# EAGLE design M8-GPIO (EAGLE 9.5.2)
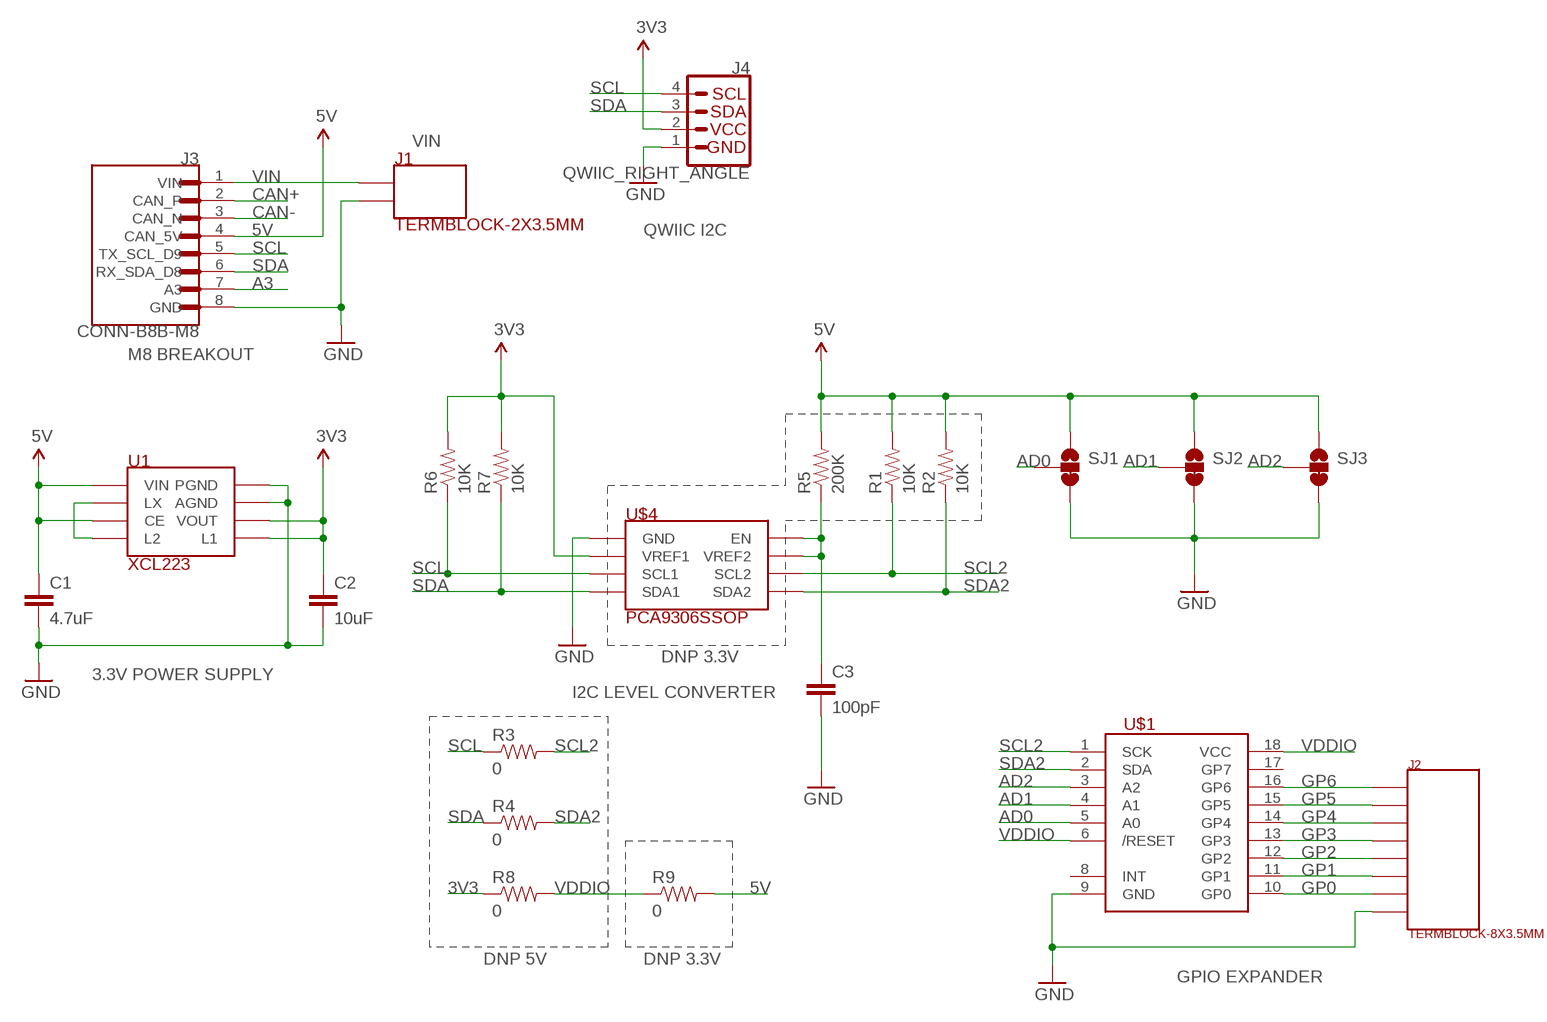
[diagram p0: schematic, sheet 1]

## Parts
C1  4.7uF  CAP-4.7UF-0603  [0603-CAP]
C2  10uF  CAP-10UF-0603  [0603-CAP]
C3  100pF  CAP-100PF-0603  [0603-CAP]
J1  TERMBLOCK-2X3.5MM  [TERMBLOCK-2X3.5MM]
J2  TERMBLOCK-8X3.5MM  [TERMBLOCK-8X3.5MM]
J3  CONN-B8B-M8  [JST_B8B-PH-SM4-TB(LF)(SN)]
J4  QWIIC_RIGHT_ANGLE  QWIIC_CONNECTORJS-1MM  [JST04_1MM_RA]
R1  10K  RES-10K-06030603  [0603-RES]
R2  10K  RES-10K-06030603  [0603-RES]
R3  0  RES-0-0603  [0603-RES]
R4  0  RES-0-0603  [0603-RES]
R5  200K  RES-200K-0603  [0603-RES]
R6  10K  RES-10K-06030603  [0603-RES]
R7  10K  RES-10K-06030603  [0603-RES]
R8  0  RES-0-0603  [0603-RES]
R9  0  RES-0-0603  [0603-RES]
SJ1  JUMPER-PAD-3-2OF3_NC_BY_TRACE_SMALL  [PAD-JUMPER-3-2OF3_NC_BY_TRACE_NO_SILK]
SJ2  JUMPER-PAD-3-2OF3_NC_BY_TRACE_SMALL  [PAD-JUMPER-3-2OF3_NC_BY_TRACE_NO_SILK]
SJ3  JUMPER-PAD-3-2OF3_NC_BY_TRACE_SMALL  [PAD-JUMPER-3-2OF3_NC_BY_TRACE_NO_SILK]
U1  XCL223  REG-XCL223  [REG-XCL223-LESS-CREAM]
U$1  MCP23008  [SOIC-18-W-MAXIM]
U$4  PCA9306SSOP  [8-SSOP-TI]

## Nets
3V3: C2.1 J4.2 R6.2 R7.2 R8.1 U1.3(VOUT) U1.7(L1) U$4.2(VREF1)
5V: C1.1 J3.4(CAN_5V) R1.2 R2.2 R5.2 R9.2 SJ1.1 SJ2.1 SJ3.1 U1.4(CE) U1.6(VIN)
A3: J3.7(A3)
AD0: SJ1.2 U$1.5(A0)
AD1: SJ2.2 U$1.4(A1)
AD2: SJ3.2 U$1.3(A2)
CAN+: J3.2(CAN_P)
CAN-: J3.3(CAN_N)
GND: C1.2 C2.2 C3.2 J1.2 J2.8 J3.8(GND) J4.1 SJ1.3 SJ2.3 SJ3.3 U1.1(PGND) U1.2(AGND) U$1.9(GND) U$4.1(GND)
GP0: J2.7 U$1.10(GP0)
GP1: J2.6 U$1.11(GP1)
GP2: J2.5 U$1.12(GP2)
GP3: J2.4 U$1.13(GP3)
GP4: J2.3 U$1.14(GP4)
GP5: J2.2 U$1.15(GP5)
GP6: J2.1 U$1.16(GP6)
LX: U1.5(LX) U1.8(L2)
SCL: J3.5(TX_SCL_D9) J4.4 R3.1 R6.1 U$4.3(SCL1)
SCL2: R1.1 R3.2 U$1.1(SCK) U$4.6(SCL2)
SDA: J3.6(RX_SDA_D8) J4.3 R4.1 R7.1 U$4.4(SDA1)
SDA2: R2.1 R4.2 U$1.2(SDA) U$4.5(SDA2)
VDDIO: R8.2 R9.1 U$1.6(/RESET) U$1.18(VCC)
VIN: J1.1 J3.1(VIN)
VREF2_EN: C3.1 R5.1 U$4.7(VREF2) U$4.8(EN)
Unconnected: U$1.8(INT) U$1.17(GP7)

## Notes on the sheet
- VIN
- QWIIC I2C
- M8 BREAKOUT
- DNP 3.3V
- 3.3V POWER SUPPLY
- I2C LEVEL CONVERTER
- DNP 5V | DNP 3.3V
- GPIO EXPANDER

## Library data of the parts
C1 = rickk2:CAP-4.7UF-0603: Murata X5R series CAP CER 4.7UF 6.3V X5R 0603 $0.12 https://www.digikey.com/product-detail/en/murata-electronics-north-america/GRM188R60J475KE19J/490-6407-1-ND/3845604
C2 = rickk2:CAP-10UF-0603: CAP CER 10UF 16V X5R 0805 $ 0.21 https://www.digikey.com/product-detail/en/murata-electronics-north-america/GRM21BR61C106KE15L/490-3886-1-ND/965928
C3 = rickk2:CAP-100PF-0603: CAP 100PF 0603
J1 = rickk2:TERMBLOCK-2X3.5MM: TERM BLK 2POS SIDE ENT 3.5MM PCB $0.67 On Shore Technology Inc. OSTTE020161M https://www.digikey.com/products/en?keywords=ED2635-ND
J2 = rickk2:TERMBLOCK-8X3.5MM: TERM BLK 8POS SIDE ENT 3.5MM PCB On Shore Technology Inc. OSTTE080161 $1.73 8 Position Wire to Board Terminal Block Horizontal with Board 0.138" (3.50mm) Through Hole https://www.digikey.com/product-detail/en/on-shore-technology-inc/OSTTE080161/ED2641-ND/614590
J3 = rickk2:CONN-B8B-M8: PH Series 2 mm Pitch 12 Position SMT Single Row Top Entry Shrouded Header
J4 = rickk2:QWIIC_CONNECTOR: SparkFun I2C Standard Qwiic Connector An SMD 1mm pitch JST connector makes it easy and quick (get it? Qwiic?) to connect I2C devices to each other. The Qwiic system <http://www.sparkfun.com/qwiic> enables fast and solderless connection between popular platforms and various sensors and actuators. We carry 200mm <https://www.sparkfun.com/products/14204>, 100mm <https://www.sparkfun.com/products/14205>, 50mm <https://www.sparkfun.com/products/14206>, and breadboard friendly <https://www.sparkfun.com/products/14207> Qwiic cables. We also offer 10 pcs strips <https://www.sparkfun.com/products/14323> the SMD connectors.; PROD_ID: CONN-13694
R1 R2 R6 R7 = rickk2:RES-10K-0603: RES SMD 10K OHM 5% 1/4W 0603 $ 0.10 https://www.digikey.com/product-detail/en/panasonic-electronic-components/ERJ-PA3J103V/P10KBZCT-ND/5036237
R3 R4 R8 R9 = rickk2:RES-0-0603: Not ordered yet RES SMD 0 OHM JUMPER 1/10W 0603 Panasonic Electronic Components ERJ-3GEY0R00V 0 Ohms Jumper 0.1W, 1/10W Chip Resistor 0603 (1608 Metric) Automotive AEC-Q200 Thick Film https://www.digikey.com/product-detail/en/panasonic-electronic-components/ERJ-3GEY0R00V/P0-0GCT-ND/134711
R5 = rickk2:RES-200K-0603: RES SMD 200K https://www.digikey.com/product-detail/en/panasonic-electronic-components/ERJ-3EKF2003V/P200KHCT-ND/198241
SJ1-SJ3 = rickk2:JUMPER-PAD-3-2OF3_NC_BY_TRACE
U1 = rickk2:REG-XCL223: Manufacturer: Torex Semiconductor Ltd Manufacturer Part Number: XCL223A333D2-G DC DC CONVERTER 3.3V Detailed Description: Non-Isolated PoL Modul $2.63 https://www.digikey.com/product-detail/en/torex-semiconductor-ltd/XCL223A333D2-G/893-1416-1-ND/8256118 CIN=4.7uF 10V CL = 10uF 10V VIN MAX=5.5V VOUT=3.3V
U$1 = rickk2:MCP23008: IC I/O EXPANDER I2C 8B 18SOIC $1.08 https://www.digikey.com/product-detail/en/microchip-technology/MCP23008T-E-SO/MCP23008T-E-SOCT-ND/5358243
U$4 = rickk2:PCA9306: IC TRNSLTR BIDIRECTIONAL SM8 PCA9306DCTR $0.67 https://www.digikey.com/product-detail/en/texas-instruments/PCA9306DCTR/296-18509-1-ND/809938 VREF1=3.3V VREF2=5V connect w/200K res and 100 pF cap to GND Use 8-SSOP version!

## Board
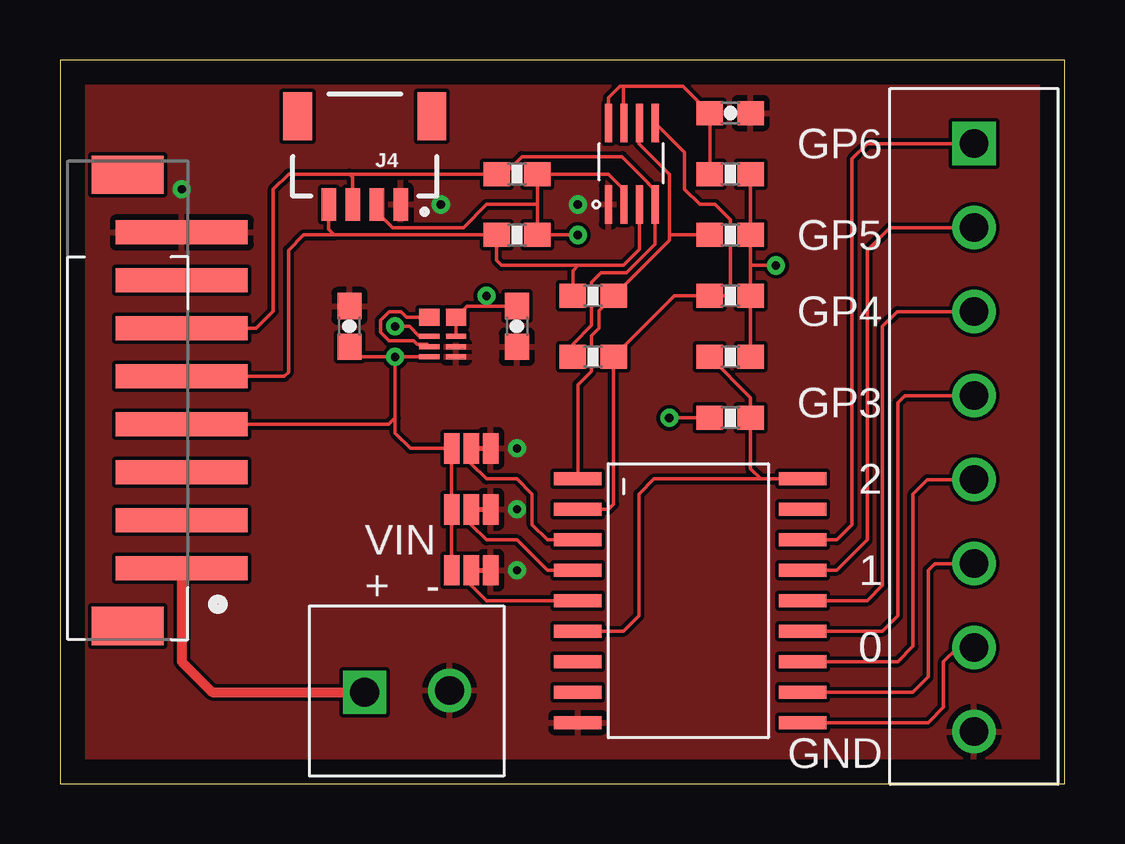
[diagram p1: board, top side]
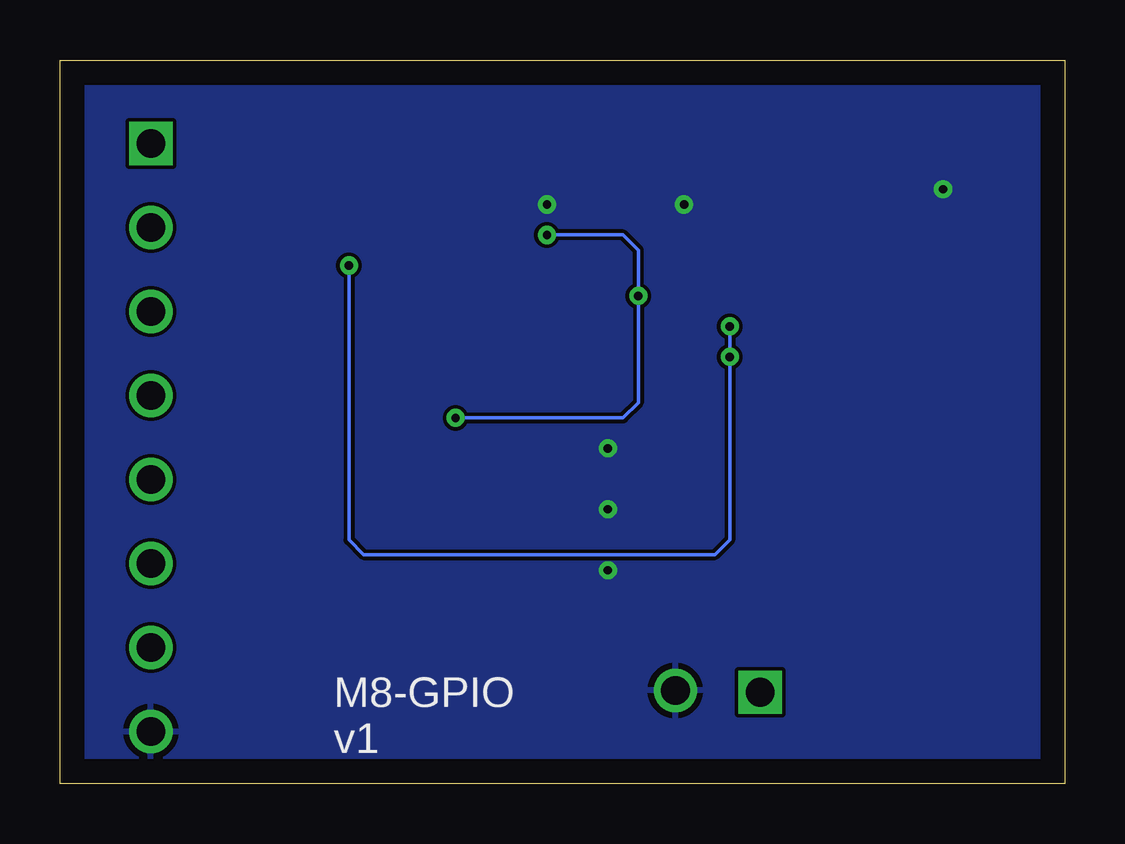
[diagram p2: board, bottom side, seen from below]

Size 41.89 x 30.15 mm. Coordinates in mm from the lower left corner, seen from the top.
Outline: 0,0 41.89,0 41.89,30.15 0,30.15 0,0
Copper layers (1*16): Top 0.035mm / dielectric 1.5mm / Bottom 0.035mm
Design rules "default": minimum track width 6mil, minimum drill 0.35mm, track to track 6mil, track to pad 6mil, pad to pad 6mil, via to via 6mil, smd to smd 6mil, copper to edge 40mil, drill to drill 6mil, minimum pad ring 10mil, minimum via ring 8mil, stop-mask expansion 4mil, vias tented up to drill 0mil, thermal gap 10mil

### Footprints (pad centres in the part's own frame; a part is rotated, then mirrored left to right if it is on the bottom)
0603-CAP = smd 1.1 x 1: 1 -0.85,0; 2 0.85,0
TERMBLOCK-2X3.5MM = drill 1.2 square: 1 0,0 | drill 1.2: 2 3.54,0.07
TERMBLOCK-8X3.5MM = drill 1.2 square: 1 0,0 | drill 1.2: 2 3.5,0; 3 7,0; 4 10.5,0; 5 14,0; 6 17.5,0; 7 21,0; 8 24.5,0
JST_B8B-PH-SM4-TB(LF)(SN) = smd 1 x 5.5: 1 -5,0; 2 -3,0; 3 -1,0; 4 1,0; 5 3,0; 6 5,0; 7 7,0; 8 9,0 | smd 1.6 x 3: P1 -7.4,2.25; P2 11.4,2.25
JST04_1MM_RA = smd 0.6 x 1.35: 1 -1.5,0; 2 -0.5,0; 3 0.5,0; 4 1.5,0 | smd 1.2 x 2: NC1 2.8,-3.675; NC2 -2.8,-3.675
0603-RES = smd 1.1 x 1: 1 -0.85,0; 2 0.85,0
PAD-JUMPER-3-2OF3_NC_BY_TRACE_NO_SILK = smd 0.635 x 1.27: 1 -0.813,0; 2 0,0; 3 0.813,0
REG-XCL223-LESS-CREAM = smd 0.85 x 0.21: 1 0,0; 2 0,0.43; 3 0,0.86; 4 -1.11,0.86; 5 -1.11,0.43; 6 -1.11,0 | smd 0.85 x 0.7: 7 0,1.655; 8 -1.11,1.655
SOIC-18-W-MAXIM = smd 0.533 x 1.981: 1 0,0; 2 1.27,0; 3 2.54,0; 4 3.81,0; 5 5.08,0; 6 6.35,0; 7 7.62,0; 8 8.89,0; 9 10.16,0; 10 10.16,9.373; 11 8.89,9.373; 12 7.62,9.373; 13 6.35,9.373; 14 5.08,9.373; 15 3.81,9.373; 16 2.54,9.373; 17 1.27,9.373; 18 0,9.373
8-SSOP-TI = smd 0.3 x 1.6: 1 0,0; 2 0.65,0; 3 1.3,0; 4 1.95,0; 5 1.95,3.4; 6 1.3,3.4; 7 0.65,3.4; 8 0,3.4

### Placement (x,y rotation side)
C1  12.06,19.05 90 top
C2  19.05,19.05 270 top
C3  27.94,27.94 0 top
J1  12.7,3.81 0 top
J2  38.1,26.67 270 top
J3  5.08,13.97 90 top
J4  12.7,24.13 180 top
R1  27.94,22.86 0 top
R2  27.94,20.32 0 top
R3  22.23,20.32 0 top
R4  22.23,17.78 0 top
R5  27.94,25.4 0 top
R6  19.05,22.86 0 top
R7  19.05,25.4 0 top
R8  27.94,15.24 0 top
R9  27.94,17.78 0 top
SJ1  17.14,8.89 0 top
SJ2  17.14,11.43 0 top
SJ3  17.14,13.97 0 top
U1  16.51,17.78 0 top
U$1  21.59,12.7 270 top
U$4  22.86,24.13 0 top

### Tracks (layer width: path | path; a pad name or v marks a point on that pad's centre or on a via)
3V3  (via drill 0.35)
  Top 0.152: U1.3 U1.7 16.98,19.9 17.78,19.9 | U$4.2 23.51,24.75 22.86,25.4 R7.2 19.9,24.13 | 17.78,19.9 C2.1 | v17.78,20.32 17.78,19.9 | J4.2 13.2,23.83 13.87,23.16 16.82,23.16 17.78,24.13 19.9,24.13 | 19.9,24.13 R6.2 v21.59,22.86 | v25.4,15.24 R8.1
  Bottom 0.152: v21.59,22.86 18.41,22.86 17.78,22.23 v17.78,20.32 17.78,15.88 18.41,15.24 v25.4,15.24
5V  (via drill 0.35)
  Top 0.152: U1.4 14.98,18.64 14.57,19.05 v13.97,19.05 | U1.6 v13.97,17.78 | v13.97,17.78 12.48,17.78 C1.1 | 28.79,21.59 R2.2 R9.2 | 28.79,21.59 R1.2 R5.2 | 28.79,21.59 v29.84,21.59 | SJ1.1 SJ2.1 SJ3.1 14.61,13.97 13.97,14.61 13.97,15.24 | J3.4 13.7,14.97 13.97,15.24 | 13.97,15.24 v13.97,17.78
  Bottom 0.152: v13.97,19.05 v13.97,17.78 13.97,10.16 14.59,9.54 29.23,9.54 29.84,10.16 v29.84,21.59
AD0
  Top 0.152: U$1.5 17.78,7.62 17.14,8.26 SJ1.2
AD1
  Top 0.152: U$1.4 20.32,8.89 19.05,10.16 17.78,10.16 17.14,10.79 SJ2.2
AD2
  Top 0.152: U$1.3 20.32,10.16 19.68,10.79 19.68,12.06 19.05,12.7 17.78,12.7 17.14,13.34 SJ3.2
GND  (via drill 0.35)
  other vias: 21.59,24.13 15.88,24.13 19.05,8.89 19.05,11.43 19.05,13.97 5.08,24.77
  pour Top: 0,0 0,31.75 48.26,31.75 48.26,0
  pour Bottom: 0,0 0,33.02 49.53,33.02 49.53,0
GP0
  Top 0.152: U$1.10 36.2,2.54 36.83,3.17 36.83,5.08 37.42,5.67 J2.7
GP1
  Top 0.152: U$1.11 35.56,3.81 36.2,4.45 36.2,8.89 36.48,9.17 J2.6
GP2
  Top 0.152: U$1.12 34.92,5.08 35.56,5.71 35.56,12.06 36.16,12.67 J2.5
GP3
  Top 0.152: U$1.13 34.29,6.35 34.92,6.99 34.92,15.88 35.22,16.17 J2.4
GP4
  Top 0.152: U$1.14 33.66,7.62 34.29,8.26 34.29,19.05 34.91,19.67 J2.3
GP5
  Top 0.152: U$1.15 32.38,8.89 33.66,10.16 33.66,22.23 34.6,23.17 J2.2
GP6
  Top 0.152: U$1.16 32.38,10.16 33.02,10.79 33.02,26.04 33.66,26.67 J2.1
LX
  Top 0.152: U1.5 15.3,18.31 14.88,18.31 14.74,18.44 13.72,18.44 13.36,18.8 13.36,19.3 13.72,19.66 14.22,19.66 14.44,19.43 U1.8
SCL
  Top 0.152: 11.43,22.86 R6.1 18.2,21.8 18.41,21.59 21.59,21.59 | J4.4 11.2,23.09 11.43,22.86 | U$4.3 24.16,22.25 23.5,21.59 21.59,21.59 | R3.1 21.38,21.38 21.59,21.59 | J3.5 9.35,16.97 9.53,17.14 9.53,22.23 10.16,22.86 11.43,22.86
SCL2
  Top 0.152: 25.4,22.86 25.4,25.4 24.13,26.67 24.13,27.5 U$4.6 | R1.1 25.4,22.86 | U$1.1 21.59,16.62 22.15,17.18 22.15,18.66 22.46,18.96 22.46,19.7 R3.2 23.73,20.98 23.75,20.98 25.4,22.63 25.4,22.64 25.4,22.86
SDA
  Top 0.152: 12.06,25.4 R7.1 18.53,25.4 19.25,26.13 23.43,26.13 24.54,25.02 24.54,24.99 24.81,24.72 U$4.4 24.81,22.47 23.62,21.29 22.55,21.29 22.15,20.88 22.15,19.09 21.38,18.31 R4.1 | J4.3 12.2,25.27 12.06,25.4 | J3.6 8.18,18.97 8.89,19.68 8.89,24.77 9.53,25.4 12.06,25.4
SDA2
  Top 0.152: U$4.5 26.04,26.3 26.04,24.77 26.67,24.13 27.3,24.13 27.94,23.5 27.94,20.32 R2.1 25.61,20.32 R4.2 23.07,11.64 22.86,11.43 U$1.2
VDDIO
  Top 0.152: R9.1 28.79,16.08 R8.2 28.79,13.12 29.21,12.7 | 29.21,12.7 U$1.18 | U$1.6 23.5,6.35 24.13,6.99 24.13,12.06 24.77,12.7 29.21,12.7
VIN
  Top 0.406: J3.1 5.08,5.08 6.35,3.81 J1.1
VREF2_EN
  Top 0.152: R5.1 C3.1 25.97,29.06 23.5,29.06 | U$4.8 22.86,28.57 23.34,29.06 23.5,29.06 | U$4.7 23.5,27.55 23.5,29.06

### Text on the board
tPlace: GP6 | GP5 | GP4 | GP3 | 2 | VIN | 1 | + | - | 0 | 0 | GND
bPlace: M8-GPIO / v1